# Altium project FEST17_Telemetry_PCB.PrjPcb
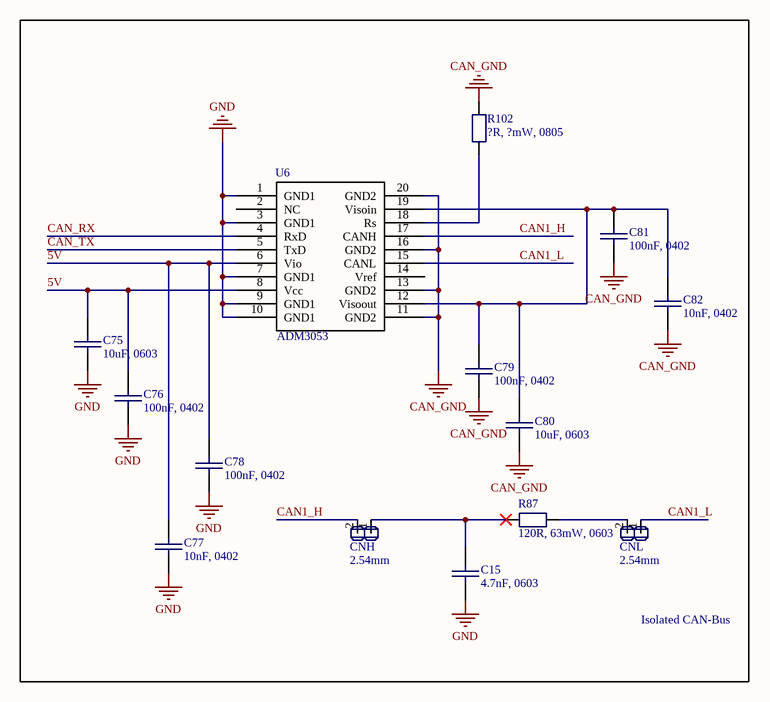
[diagram p0: Isoleeritud_can.SchDoc]
4 sheets, 74 parts. Net scope: global (net labels, ports and power ports of the same name join across sheets).
Board file: Telemeetria.PcbDoc
Sheets:
  Isoleeritud_can.SchDoc
  Elektriskeem.SchDoc
  24V_to_3V3_regulator.SchDoc
  24V_to_5V_regulator.SchDoc

## Sheet Isoleeritud_can.SchDoc
size A4

### Parts
C15  4.7nF, 0603  [1608 [0603] CAP]
C75  10uF, 0603  [1608 [0603] CAP]
C76  100nF, 0402  [1005 [0402] CAP]
C77  10nF, 0402  [1005 [0402] CAP]
C78  100nF, 0402  [1005 [0402] CAP]
C79  100nF, 0402  [1005 [0402] CAP]
C80  10uF, 0603  [1608 [0603] CAP]
C81  100nF, 0402  [1005 [0402] CAP]
C82  10nF, 0402  [1005 [0402] CAP]
CNH  2.54mm  [Pin Header 2x1]
CNL  2.54mm  [Pin Header 2x1]
R87  120R, 63mW, 0603  [1608 [0603] RES]
R102  ?R, ?mW, 0805  [1608 [0603] RES]
U6  1  [ADM3053 CAN IC]  (value not drawn)

### Blocks framed on the sheet
Isolated CAN-Bus: C15 C75-C82 CNH CNL R87 R102 U6

### Nets
5V: C75.1 C76.1 C77.1 C78.1 U6.6(Vio) U6.8(Vcc)
CAN_GND: C79.2 C80.2 C81.2 C82.2 R102.2 U6.11(GND2) U6.13(GND2) U6.16(GND2) U6.20(GND2)
GND: C15.2 C75.2 C76.2 C77.2 C78.2 U6.1(GND1) U6.3(GND1) U6.7(GND1) U6.9(GND1) U6.10(GND1)
CAN1_H: CNH.2 U6.17(CANH)
CAN1_L: CNL.1 U6.15(CANL)
CAN_RX: U6.4(RxD)
CAN_TX: U6.5(TxD)
NetC15_1: C15.1 CNH.1 R87.1
NetC79_1: C79.1 C80.1 C81.1 C82.1 U6.12(Visoout) U6.19(Visoin)
NetCNL_2: CNL.2 R87.2
NetR102_1: R102.1 U6.18(Rs)

Not connected (* = marked no-connect by the designer): U6 2(NC) 14(Vref)

### Notes on the sheet
- (in symbol Component_1) ADM3053

### Library data of the parts
C15 C75-C82 = Capacitor: Manufacturer: *; Product Name: *; Supplier Number: *; Supplier: Farnell; Notes: *
CNH CNL = Pin Header 2x1: Manufacturer: *; Product Name: *; Supplier Number: *; Supplier: *; Notes: *
R87 = Resistor: Manufacturer: YAGEO (PHYCOMP); Product Name: RC0603FR-07120RL; Product Number: Farnell 9238379
R102 = Resistor: Manufacturer: *; Product Name: *; Supplier Number: *; Supplier: Farnell; Notes: *
U6 = Component_1

## Sheet Elektriskeem.SchDoc
size A4
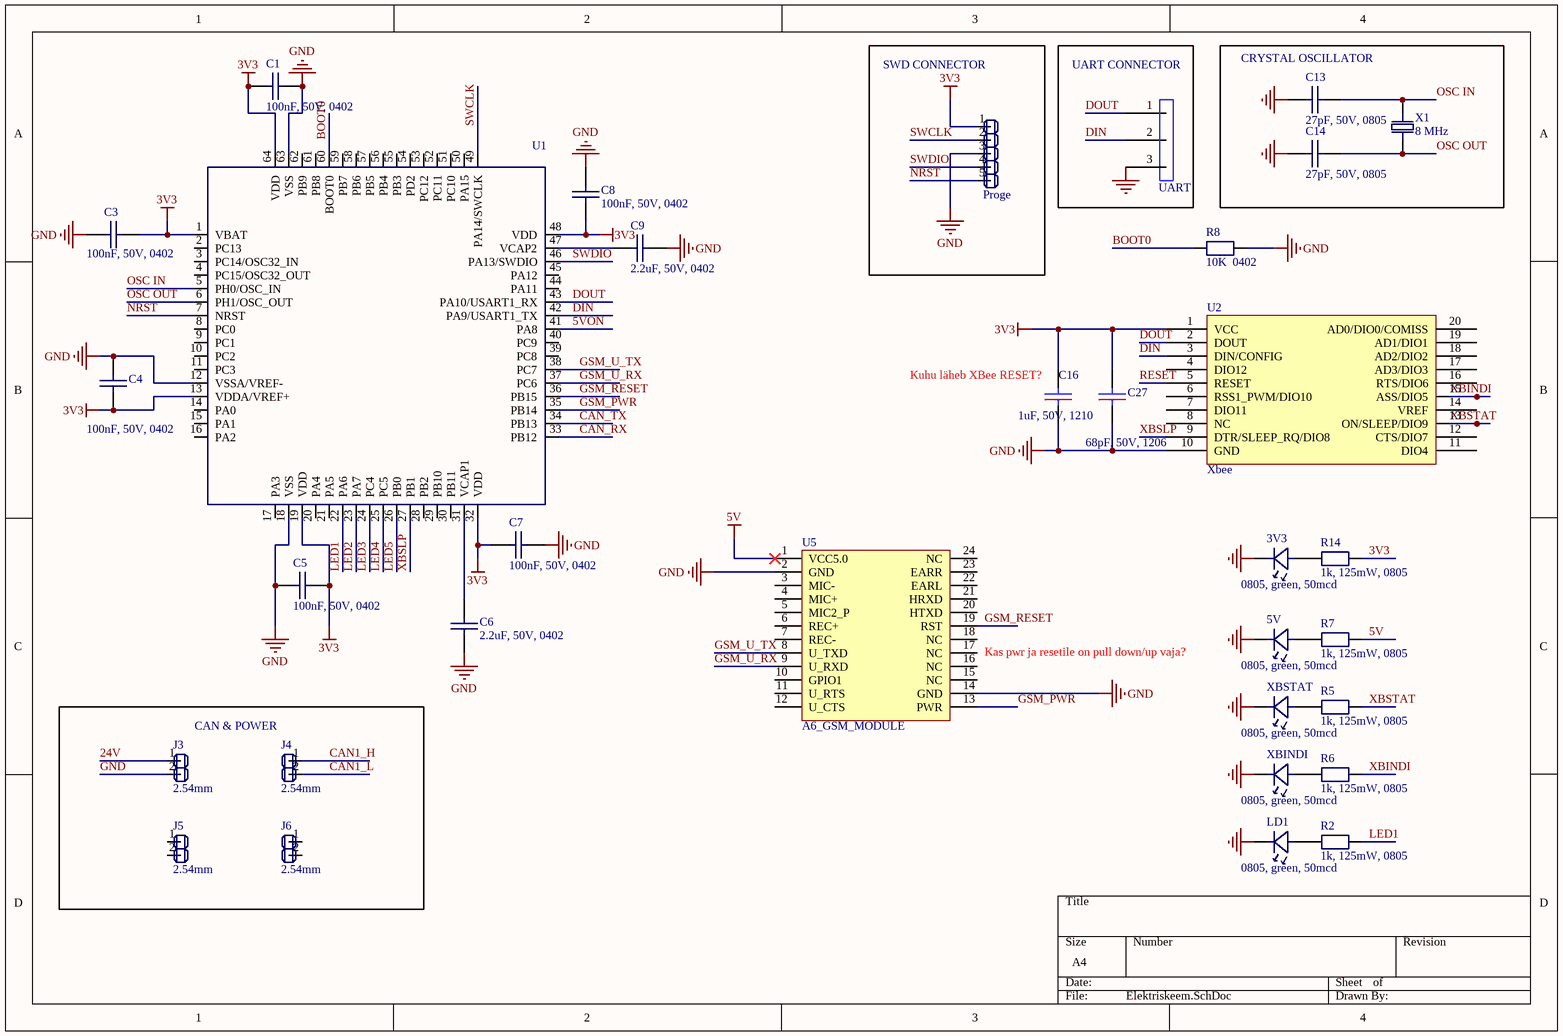
[diagram p1: Elektriskeem.SchDoc]

### Parts
3V3  0805, green, 50mcd  [LED2012X06N]
5V  0805, green, 50mcd  [LED2012X06N]
C1  100nF, 50V, 0402  [1005 [0402] CAP]
C3  100nF, 50V, 0402  [1005 [0402] CAP]
C4  100nF, 50V, 0402  [1005 [0402] CAP]
C5  100nF, 50V, 0402  [1005 [0402] CAP]
C6  2.2uF, 50V, 0402  [1005 [0402] CAP]
C7  100nF, 50V, 0402  [1005 [0402] CAP]
C8  100nF, 50V, 0402  [1005 [0402] CAP]
C9  2.2uF, 50V, 0402  [1005 [0402] CAP]
C13  27pF, 50V, 0805  [2012 [0805] CAP]
C14  27pF, 50V, 0805  [2012 [0805] CAP]
C16  1uF, 50V, 1210  [3225 [1210] CAP]
C27  68pF, 50V, 1206  [3216 [1206] CAP]
J3  2.54mm  [Pin Header 2x1]
J4  2.54mm  [Pin Header 2x1]
J5  2.54mm  [Pin Header 2x1]
J6  2.54mm  [Pin Header 2x1]
LD1  0805, green, 50mcd  [LED2012X06N]
Proge  Pin Header 5x1  [Pin Header 5x1]  (value not drawn)
R2  1k, 125mW, 0805  [2012 [0805] RES]
R5  1k, 125mW, 0805  [2012 [0805] RES]
R6  1k, 125mW, 0805  [2012 [0805] RES]
R7  1k, 125mW, 0805  [2012 [0805] RES]
R8  10K  0402  [1005 [0402] RES]
R14  1k, 125mW, 0805  [2012 [0805] RES]
U1  STM32F4 64-pin  [LQFP64]  (value not drawn)
U2  Xbee  [XBEE - duplicate1]
U5  A6_GSM_MODULE  [A6_gsm_module]
UART  Pin Header 3x1  [Pin Header 3x1]  (value not drawn)
X1  8 MHz  [5.0x3.2 SMD Crystal]
XBINDI  0805, green, 50mcd  [LED2012X06N]
XBSTAT  0805, green, 50mcd  [LED2012X06N]

### Blocks framed on the sheet
SWD CONNECTOR: Proge
UART CONNECTOR: UART
CRYSTAL OSCILLATOR: C13 C14 X1
CAN & POWER: J3-J6

### Nets
3V3: C1.2 C3.1 C4.2 C5.1 C7.2 C8.2 C16.1 C27.1 Proge.1 R14.2 U1.1(VBAT) U1.13(VDDA/VREF+) U1.19(VDD) U1.32(VDD) U1.48(VDD) U1.64(VDD) U2.1(VCC)
5V: R7.2 U5.1(VCC5.0)
24V: J3.1
GND: 3V3.1 5V.1 C1.1 C3.2 C4.1 C5.2 C6.2 C7.1 C8.1 C9.1 C13.2 C14.1 C16.2 C27.2 J3.2 LD1.1 Proge.3 R8.2 U1.12(VSSA/VREF-) U1.18(VSS) U1.63(VSS) U2.10(GND) U5.2(GND) U5.14(GND) UART.3 XBINDI.1 XBSTAT.1
5VON: U1.41(PA8)
BOOT0: R8.1 U1.60(BOOT0)
CAN1_H: J4.1
CAN1_L: J4.2
CAN_RX: U1.33(PB12)
CAN_TX: U1.34(PB13)
DIN: U1.42(PA9/USART1_TX) U2.3(DIN/CONFIG) UART.2
DOUT: U1.43(PA10/USART1_RX) U2.2(DOUT) UART.1
GSM_PWR: U1.35(PB14) U5.13(PWR)
GSM_RESET: U1.36(PB15) U5.19(RST)
GSM_U_RX: U1.37(PC6) U5.9(U_RXD)
GSM_U_TX: U1.38(PC7) U5.8(U_TXD)
LED1: R2.2 U1.22(PA6)
LED2: U1.23(PA7)
LED3: U1.24(PC4)
LED4: U1.25(PC5)
LED5: U1.26(PB0)
NRST: Proge.5 U1.7(NRST)
OSC IN: C13.1 U1.5(PH0/OSC_IN) X1.1
OSC OUT: C14.2 U1.6(PH1/OSC_OUT) X1.2
RESET: U2.5(RESET)
SWCLK: Proge.2 U1.49(PA14/SWCLK)
SWDIO: Proge.4 U1.46(PA13/SWDIO)
XBINDI: R6.2 U2.15(ASS/DIO5)
XBSLP: U1.27(PB1) U2.9(DTR/SLEEP_RQ/DIO8)
XBSTAT: R5.2 U2.13(ON/SLEEP/DIO9)
Net3V3_2: 3V3.2 R14.1
Net5V_2: 5V.2 R7.1
NetC6_1: C6.1 U1.31(VCAP1)
NetC9_2: C9.2 U1.47(VCAP2)
NetLD1_2: LD1.2 R2.1
NetR5_1: R5.1 XBSTAT.2
NetR6_1: R6.1 XBINDI.2

Not connected (* = marked no-connect by the designer): J5 1 2; J6 1 2; U1 2(PC13) 3(PC14/OSC32_IN) 4(PC15/OSC32_OUT) 8(PC0) 9(PC1) 10(PC2) 11(PC3) 14(PA0) 15(PA1) 16(PA2) 17(PA3) 20(PA4) 21(PA5) 28(PB2) 29(PB10) 30(PB11) 39(PC8) 40(PC9) 44(PA11) 45(PA12) 50(PA15) 51(PC10) 52(PC11) 53(PC12) 54(PD2) 55(PB3) 56(PB4) 57(PB5) 58(PB6) 59(PB7) 61(PB8) 62(PB9); U2 4(DIO12) 6(RSS1_PWM/DIO10) 7(DIO11) 8(NC) 11(DIO4) 12(CTS/DIO7) 14(VREF) 16(RTS/DIO6) 17(AD3/DIO3) 18(AD2/DIO2) 19(AD1/DIO1) 20(AD0/DIO0/COMISS); U5 3(MIC-) 4(MIC+) 5(MIC2_P) 6(REC+) 7(REC-) 10(GPIO1) 11(U_RTS) 12(U_CTS) 15(NC) 16(NC) 17(NC) 18(NC) 20(HTXD) 21(HRXD) 22(EARL) 23(EARR) 24(NC)

### Notes on the sheet
- (near C16) Kuhu läheb XBee RESET?
- Kas pwr ja resetile on pull down/up vaja?

### Library data of the parts
3V3 5V LD1 XBINDI XBSTAT = LED: Cathode (-) marked by silkscreen line; Manufacturer: KINGBRIGHT; Product Name: KP-2012CGCK; Product Number: Farnell 2290331
C1 C3-C9 = Capacitor: Manufacturer: *; Product Name: *; Supplier Number: *; Supplier: Farnell; Notes: *
C13 C14 = Capacitor: Manufacturer: KEMET; Product Name: C0805C270J5GACTU; Product Number: Farnell 1414683
C16 = Capacitor: Product Number: GRM32ER71H105KA01L; Manufacturer: *; Product Name: *
C27 = Capacitor: Product Number: 12065A680JAT2A; Manufacturer: *; Product Name: *
J3-J6 = Pin Header 2x1: Manufacturer: *; Product Name: *; Supplier Number: *; Supplier: *; Notes: *
Proge = Pin Header 5x1: Manufacturer: TE CONNECTIVITY; Product Name: 640456-5; Product Number: Farnell 588600
R2 R5-R7 R14 = Resistor: Manufacturer: VISHAY DRALORIC; Product Name: CRCW08051K00FKTA; Product Number: Farnell 1652936
R8 = Resistor: Manufacturer: *; Product Name: *; Supplier Number: *; Supplier: Farnell; Notes: *
U1 = STM32F4 64-pin: Manufacturer: STMICROELECTRONICS; Product Name: STM32F405RGT6W; Product Number: Farnell 2333283
X1 = Crystal: Manufacturer: ABRACON; Product Name: ABM3-8.000MHZ-D2Y-T; Product Number: Farnell 2101329
UART = Pin Header 3x1: Manufacturer: *; Product Name: *; Product Number: *

## Sheet 24V_to_3V3_regulator.SchDoc
size A4
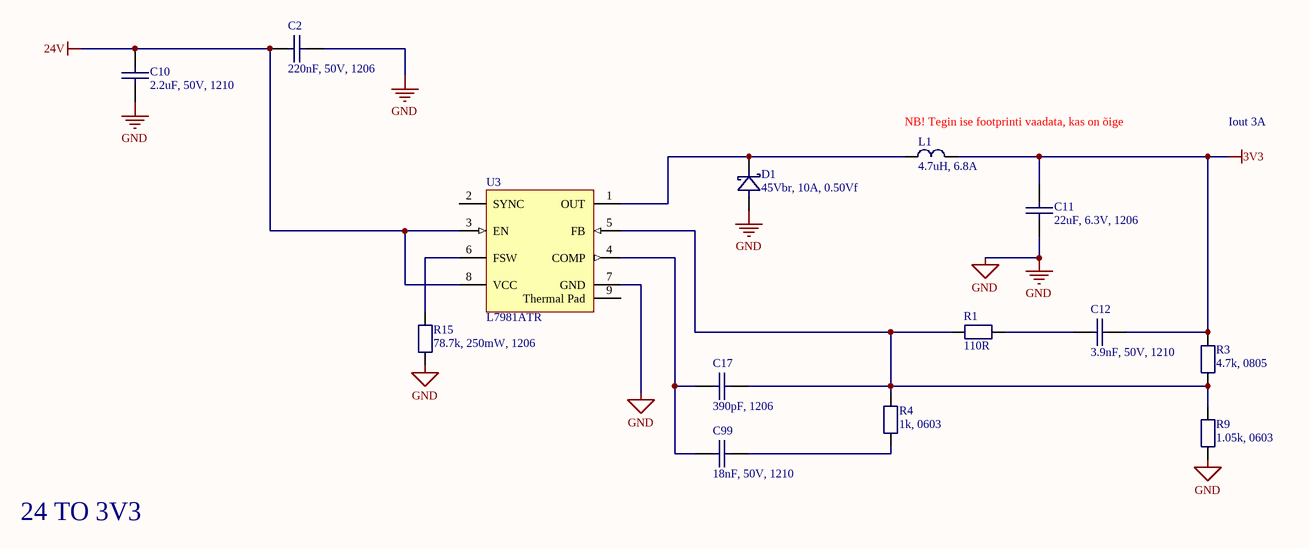
[diagram p2: 24V_to_3V3_regulator.SchDoc]

### Parts
C2  220nF, 50V, 1206  [3216 [1206] CAP]
C10  2.2uF, 50V, 1210  [3225 [1210] CAP]
C11  22uF, 6.3V, 1206  [3216 [1206] CAP]
C12  3.9nF, 50V, 1210  [3225 [1210] CAP]
C17  390pF, 1206  [3216 [1206] CAP]
C99  18nF, 50V, 1210  [2012 [0805] CAP]
D1  45Vbr, 10A, 0.50Vf  [DPAK (TO252-3)]
L1  4.7uH, 6.8A  [12.5 x 12.5 x 8.5 (mm)]
R1  110R  [2012 [0805] RES]
R3  4.7k, 0805  [2012 [0805] RES]
R4  1k, 0603  [1608 [0603] RES]
R9  1.05k, 0603  [1608 [0603] RES]
R15  78.7k, 250mW, 1206  [3216 [1206] RES]
U3  L7981ATR  [HSOP8-D1_N]

### Nets
3V3: C11.1 C12.1 L1.2 R3.2
24V: C2.2 C10.1 U3.3(EN) U3.8(VCC)
GND: C2.1 C10.2 C11.2 D1.2 R9.1 R15.1 U3.7(GND)
NetC12_2: C12.2 R1.2
NetC17_1: C17.1 R1.1 R3.1 R4.2 R9.2 U3.5(FB)
NetC17_2: C17.2 C99.2 U3.4(COMP)
NetC99_1: C99.1 R4.1
NetD1_1: D1.1 L1.1 U3.1(OUT)
NetR15_2: R15.2 U3.6(FSW)

Not connected (* = marked no-connect by the designer): U3 2(SYNC) 9(Thermal_Pad)

### Notes on the sheet
- (near L1) NB! Tegin ise footprinti vaadata, kas on õige
- Iout 3A
- 24 TO 3V3

### Library data of the parts
C2 = Capacitor: Product Name: CM316X7R224K50AT; Manufacturer: *; Supplier Number: 1216553; Supplier: Farnell; Notes: *
C10 = Capacitor: Product Name: CGA6M3X7R1H225K200AB; Manufacturer: *; Supplier Number: 2346972; Supplier: Farnell; Notes: *
C11 = Capacitor: Product Name: 12066C226KAT2A; Manufacturer: *; Supplier Number: 2526283; Supplier: Farnell; Notes: *
C12 = Capacitor: Product Name: 12105A392JAT2A; Manufacturer: *; Supplier Number: *; Supplier: Mouser; Notes: *
C17 = Capacitor: Product Name: 12065A391JAT2A; Manufacturer: *; Supplier Number: 2332871; Supplier: Farnell; Notes: *
C99 = Capacitor: Product Name: 12105C183KAT2A; Manufacturer: *; Supplier: Mouser; Notes: *
D1 = Diode Shottky: pin to pad: 1>2 2>3; Product Name: STPS1045B; Manufacturer: *; Supplier Number: 9907297; Supplier: Farnell; Notes: *
L1 = Inductor: Product Name: B82477G4472M000; Manufacturer: *; Supplier Number: 7430329; Supplier: Farnell; Notes: *
R1 R3 R4 R9 R15 = Resistor: Manufacturer: *; Product Name: *; Supplier Number: *; Supplier: Farnell; Notes: *
U3 = L7981ATR: 3 A step-down switching regulator, 8-Pin HSOP, Tape and Reel; DatasheetVersion: Jul-2010; PackageVersion: 2010; PackageReference: HSOP8-D1; PackageDescription: 8-Pin Small Outline Integrated Circuit 1.27 mm Pitch; ComponentLink1Description: Manufacturer URL; ComponentLink1URL: http://www.st.com; ComponentLink2Description: Datasheet; ComponentLink2URL: http://www.st.com/internet/com/TECHNICAL_RESOURCES/TECHNICAL_LITERATURE/DATASHEET/CD00217474.pdf

## Sheet 24V_to_5V_regulator.SchDoc
size A4
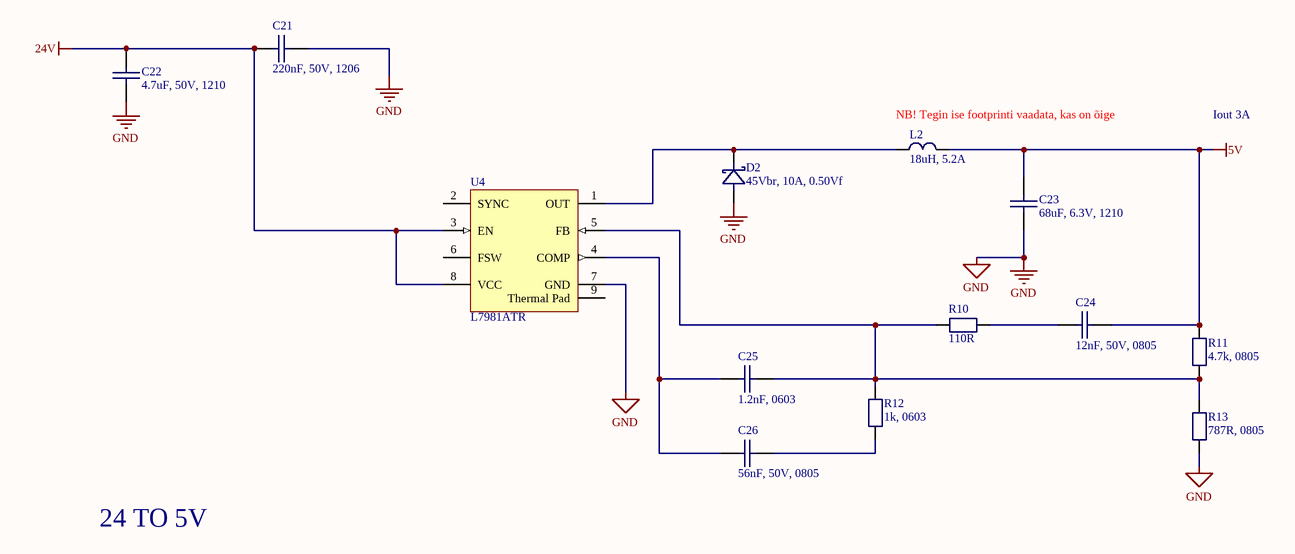
[diagram p3: 24V_to_5V_regulator.SchDoc]

### Parts
C21  220nF, 50V, 1206  [3216 [1206] CAP]
C22  4.7uF, 50V, 1210  [3225 [1210] CAP]
C23  68uF, 6.3V, 1210  [3225 [1210] CAP]
C24  12nF, 50V, 0805  [2012 [0805] CAP]
C25  1.2nF, 0603  [1608 [0603] CAP]
C26  56nF, 50V, 0805  [2012 [0805] CAP]
D2  45Vbr, 10A, 0.50Vf  [DPAK (TO252-3)]
L2  18uH, 5.2A  [SRR12xx IND]
R10  110R  [2012 [0805] RES]
R11  4.7k, 0805  [2012 [0805] RES]
R12  1k, 0603  [1608 [0603] RES]
R13  787R, 0805  [2012 [0805] RES]
U4  L7981ATR  [HSOP8-D1_N]

### Nets
5V: C23.1 C24.1 L2.2 R11.2
24V: C21.2 C22.1 U4.3(EN) U4.8(VCC)
GND: C21.1 C22.2 C23.2 D2.2 R13.1 U4.7(GND)
NetC24_2: C24.2 R10.2
NetC25_1: C25.1 R10.1 R11.1 R12.2 R13.2 U4.5(FB)
NetC25_2: C25.2 C26.2 U4.4(COMP)
NetC26_1: C26.1 R12.1
NetD2_1: D2.1 L2.1 U4.1(OUT)

Not connected (* = marked no-connect by the designer): U4 2(SYNC) 6(FSW) 9(Thermal_Pad)

### Notes on the sheet
- (near L2) NB! Tegin ise footprinti vaadata, kas on õige
- Iout 3A
- 24 TO 5V

### Library data of the parts
C21 = Capacitor: Product Name: CM316X7R224K50AT; Manufacturer: *; Supplier Number: 1216553; Supplier: Farnell; Notes: *
C22 = Capacitor: Product Name: GRM32ER71H475KA88L; Manufacturer: *; Supplier Number: 1828841; Supplier: Farnell; Notes: *
C23 = Capacitor: Product Name: C3225X5R0J686M200AC; Manufacturer: *; Supplier Number: 2526283; Supplier: Farnell; Notes: *
C24 = Capacitor: Product Name: GRM2195C1H123JA01D; Manufacturer: *; Supplier Number: *; Supplier: Mouser; Notes: *
C25 = Capacitor: Product Name: 06035A122JAT2A; Manufacturer: *; Supplier Number: *; Supplier: Mouser; Notes: *
C26 = Capacitor: Product Name: MC0805B563K500CT; Manufacturer: *; Supplier Number: 1759261; Supplier: Farnell; Notes: *
D2 = Diode Shottky: pin to pad: 1>2 2>3; Product Name: STPS1045B; Manufacturer: *; Supplier Number: 9907297; Supplier: Farnell; Notes: *
L2 = Inductor: Product Name: 744770118; Manufacturer: *; Supplier Number: 2082594; Supplier: Farnell; Notes: *
R10-R13 = Resistor: Manufacturer: *; Product Name: *; Supplier Number: *; Supplier: Farnell; Notes: *
U4 = L7981ATR: as U3 on sheet 24V_to_3V3_regulator; DatasheetVersion: Jul-2010; PackageVersion: 2010; PackageReference: HSOP8-D1; PackageDescription: 8-Pin Small Outline Integrated Circuit 1.27 mm Pitch; ComponentLink1Description: Manufacturer URL; ComponentLink1URL: http://www.st.com; ComponentLink2Description: Datasheet; ComponentLink2URL: http://www.st.com/internet/com/TECHNICAL_RESOURCES/TECHNICAL_LITERATURE/DATASHEET/CD00217474.pdf; Supplier: *; Supplier Number: *

## Nets that join several sheets
3V3: Elektriskeem (17 pins), 24V_to_3V3_regulator (C11.1 C12.1 L1.2 R3.2)
5V: Isoleeritud_can (6 pins), Elektriskeem (R7.2 U5.1), 24V_to_5V_regulator (C23.1 C24.1 L2.2 R11.2)
24V: Elektriskeem (J3.1), 24V_to_3V3_regulator (C2.2 C10.1 U3.3 U3.8), 24V_to_5V_regulator (C21.2 C22.1 U4.3 U4.8)
GND: Isoleeritud_can (10 pins), Elektriskeem (27 pins), 24V_to_3V3_regulator (7 pins), 24V_to_5V_regulator (6 pins)
CAN1_H: Isoleeritud_can (CNH.2 U6.17), Elektriskeem (J4.1)
CAN1_L: Isoleeritud_can (CNL.1 U6.15), Elektriskeem (J4.2)
CAN_RX: Isoleeritud_can (U6.4), Elektriskeem (U1.33)
CAN_TX: Isoleeritud_can (U6.5), Elektriskeem (U1.34)